# Altium project TM_DE_REV1.0.PrjPcb (part 2 of 2)

## Sheet 04_USB_UART_Service.SchDoc: USB_UART_Service
size A4; DrawnBy: YILDIRIM_DOGRU
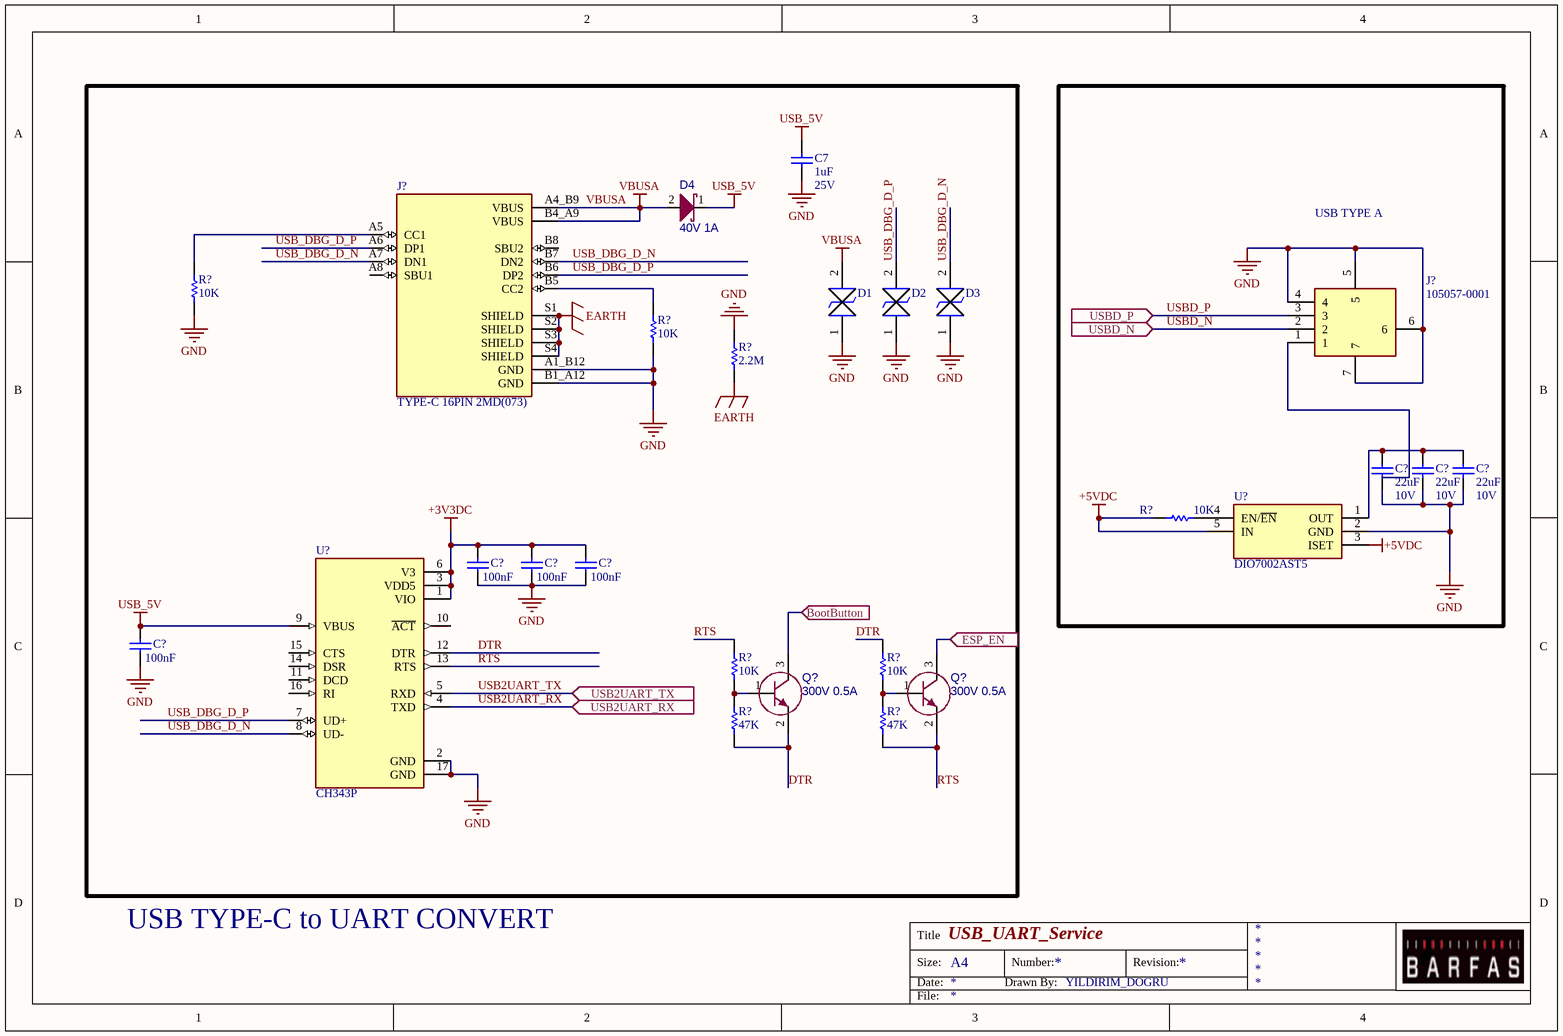
[diagram p9: 04_USB_UART_Service.SchDoc]

### Parts
(Parts that share a designator on the sheet are numbered #1, #2 ... from top to bottom, then left to right.)
C7#1  value 1uF  Voltage: 25V  [CAP_0603]  (hidden comment: CL10A105KA8NNNC)
C?#13  value 22uF  Voltage: 10V  [CAP_0805]  (hidden comment: CL21A226MPCLRNC)
C?#14  value 22uF  Voltage: 10V  [CAP_0805]  (hidden comment: CL21A226MPCLRNC)
C?#15  value 22uF  Voltage: 10V  [CAP_0805]  (hidden comment: CL21A226MPCLRNC)
C?#16  value 100nF  [CAP_0603]  (hidden comment: CL10B104KB8NNNL)
C?#17  value 100nF  [CAP_0603]  (hidden comment: CL10B104KB8NNNL)
C?#18  value 100nF  [CAP_0603]  (hidden comment: CL10B104KB8NNNL)
C?#19  value 100nF  [CAP_0603]  (hidden comment: CL10B104KB8NNNL)
D1#1  ATV02W5V0B-HF  [SODFL3718X130N]  (value not drawn)
D2  ATV02W5V0B-HF  [SODFL3718X130N]  (value not drawn)
D3#2  ATV02W5V0B-HF  [SODFL3718X130N]  (value not drawn)
D4  value 40V 1A  [SOD-123]  (hidden comment: PMEG4010EGWJ)
J?#2  TYPE-C 16PIN 2MD(073)  [HRO_TYPE-C-31-M-12]
J?#3  105057-0001  [1050570001]
Q?#1  value 300V 0.5A  [SOT-23-3]  (hidden comment: MMBTA42_R1_00001)
Q?#2  value 300V 0.5A  [SOT-23-3]  (hidden comment: MMBTA42_R1_00001)
R?#1  value 10K  [RES_0402]  (hidden comment: RC0402JR-0710KL)
R?#2  value 10K  [RES_0402]  (hidden comment: RC0402JR-0710KL)
R?#3  value 2.2M  [RES_0805]  (hidden comment: RES)
R?#4  value 10K  [RES_0402]  (hidden comment: RC0402JR-0710KL)
R?#5  value 10K  [RES_0402]  (hidden comment: RC0402JR-0710KL)
R?#6  value 10K  [RES_0402]  (hidden comment: RC0402JR-0710KL)
R?#7  value 47K  [RES_0603]  (hidden comment: 0603SAF4702T5E)
R?#8  value 47K  [RES_0603]  (hidden comment: 0603SAF4702T5E)
U?#15  DIO7002AST5  [SOT95P280X125-5N]
U?#16  CH343P  [QFN50P300X300X80-17N]

### Blocks framed on the sheet
USB TYPE A: C?#13-C?#15 J?#3 R?#4 U?#15

### Ports
BootButton (in), ESP_EN (in), USB2UART_RX (in), USB2UART_TX (in), USBD_N (in), USBD_P (in)

### Nets
+3V3DC: C?#16.2 C?#17.2 C?#18.2 U?#16.1(VIO) U?#16.3(VDD5) U?#16.6(V3)
+5VDC: R?#4.2 U?#15.3(ISET) U?#15.5(IN)
EARTH: J?#2.S1(SHIELD) J?#2.S2(SHIELD) J?#2.S3(SHIELD) J?#2.S4(SHIELD) R?#3.1
GND: C7#1.2 C?#13.2 C?#14.2 C?#15.2 C?#16.1 C?#17.1 C?#18.1 C?#19.1 D1#1.1 D2.1 D3#2.1 J?#2.A1_B12(GND) J?#2.B1_A12(GND) J?#3.4 J?#3.5 J?#3.6 J?#3.7 R?#1.1 R?#2.1 R?#3.2 U?#15.2(GND) U?#16.2(GND) U?#16.17(GND)  [project net TVSS]
USB_5V: C7#1.1 C?#19.2 D4.1 U?#16.9(VBUS)
VBUSA: D1#1.2 D4.2 J?#2.A4_B9(VBUS) J?#2.B4_A9(VBUS)
DTR: Q?#1.2(E) R?#6.2 R?#7.1 U?#16.12(DTR)
RTS: Q?#2.2(E) R?#5.2 R?#8.1 U?#16.13(RTS)
USB2UART_RX: U?#16.4(TXD) ; port USB2UART_RX
USB2UART_TX: U?#16.5(RXD) ; port USB2UART_TX
USB_DBG_D_N: D3#2.2 J?#2.A7(DN1) J?#2.B7(DN2) U?#16.8(UD-)
USB_DBG_D_P: D2.2 J?#2.A6(DP1) J?#2.B6(DP2) U?#16.7(UD+)
USBD_N: J?#3.2 ; port USBD_N
USBD_P: J?#3.3 ; port USBD_P
NetC?#13_1: C?#13.1 C?#14.1 C?#15.1 U?#15.1(OUT)
NetJ?#2_A5: J?#2.A5(CC1) R?#1.2
NetJ?#2_B5: J?#2.B5(CC2) R?#2.2
NetQ?#1_1: Q?#1.1(B) R?#5.1 R?#7.2
NetQ?#1_3: Q?#1.3(C) ; port BootButton
NetQ?#2_1: Q?#2.1(B) R?#6.1 R?#8.2
NetQ?#2_3: Q?#2.3(C) ; port ESP_EN
NetR?#4_1: R?#4.1 U?#15.4(EN/~{EN})

Not connected (* = marked no-connect by the designer): J?#2 A8(SBU1) B8(SBU2); J?#3 1; U?#16 10(~{ACT}) 11(DCD) 14(DSR) 15(CTS) 16(RI)

### Notes on the sheet
- USB TYPE-C to UART CONVERT
- Title
- Size:
- Date:
- A4
- Drawn By:
- Number:
- Revision:
- File:

### Library data of the parts
C7#1 = C01757: CAP CER 1UF 25VDC %10 X5R SMD; Manufacturer: Samsung; Manufacturer Part Number: CL10A105KA8NNNC
C?#13-C?#15 = C01758: MLCC (2012) 0805 22uF 10VDC ±20% X5R; Manufacturer: Samsung; Manufacturer Part Number: CL21A226MPCLRNC
C?#16-C?#19 = CL10B104KB8NNNL: MLCC (1608) 0603 100nF 50VDC ±10% X7R; Manufacturer: Samsung Electro-Mechanics America, Inc; Supplier 1: OZDISAN; Manufacturer Part Number: CL10B104KB8NNNL
D1#1 D2 D3#2 = ATV02W5V0B-HF: TVS Diode (Bi-directional); Manufacturer: Comchip Technology; Manufacturer Part Number: ATV02W5V0B-HF
D4 = PMEG4010EGWJ: DIODE SCHOTTKY 40V 1A SOD123; Manufacturer: Nexperia USA Inc.; Manufacturer Part Number: PMEG4010EGWJ
J?#2 = TYPE-C-31-M-12: CONN RCPT Type-C 16POS SMD R/A; Manufacturer: SHOU HAN; Value: *; Manufacturer Part Number: TYPE-C 16PIN 2MD(073)
J?#3 = 105057-0001: CONN RCPT USB2.0 TYPEA 4POS VERT; Manufacturer: Molex; Manufacturer Part Number: 105057-0001
Q?#1 Q?#2 = MMBTA42_R1_00001: as Q12#1 on sheet 07_LTE_GNSS; Package: SOT23; Supplier Part Number 1: 3757-MMBTA42_R1_00001CT-ND; Supplier Part Number 2: *; Supplier Part Number 3: MMBTA42_R1_00001; Supplier 1: DIGIKEY; Supplier 2: MOUSER; Supplier 3: OZDISAN; Manufacturer Part Number: MMBTA42_R1_00001
R?#1 R?#2 R?#4-R?#6 = R03000: as R16#3 on sheet 07_LTE_GNSS; Manufacturer Part Number: RC0402JR-0710KL
R?#3 = R01913: RES SMD 2.2M OHM 1% 1/8W 0805; Manufacturer: Yageo; Manufacturer Part Number: RC0805FR-072M2L
R?#7 R?#8 = 0603SAF4702T5E: as R17 on sheet 07_LTE_GNSS; Supplier 1: Ozdisan; Manufacturer Part Number: 0603SAF4702T5E
U?#15 = DIO7002AST5: Low Loss Power Distribution Switch; Manufacturer: DIOO Microcircuits; Manufacturer Part Number: DIO7002AST5
U?#16 = CH343P: USB to High-Speed Serial Chip CH343; Manufacturer: WCH; SnapEDA_Link: https://www.snapeda.com/parts/CH343P/WCH/view-part/?ref=snap; Package: Package; Value: *; Manufacturer Part Number: CH343P; Check_prices: https://www.snapeda.com/parts/CH343P/WCH/view-part/?ref=eda

## Sheet 03_Vehicle_Interfaces.SchDoc: Vehicle Interfaces
size A4; DrawnBy: YILDIRIM_DOGRU
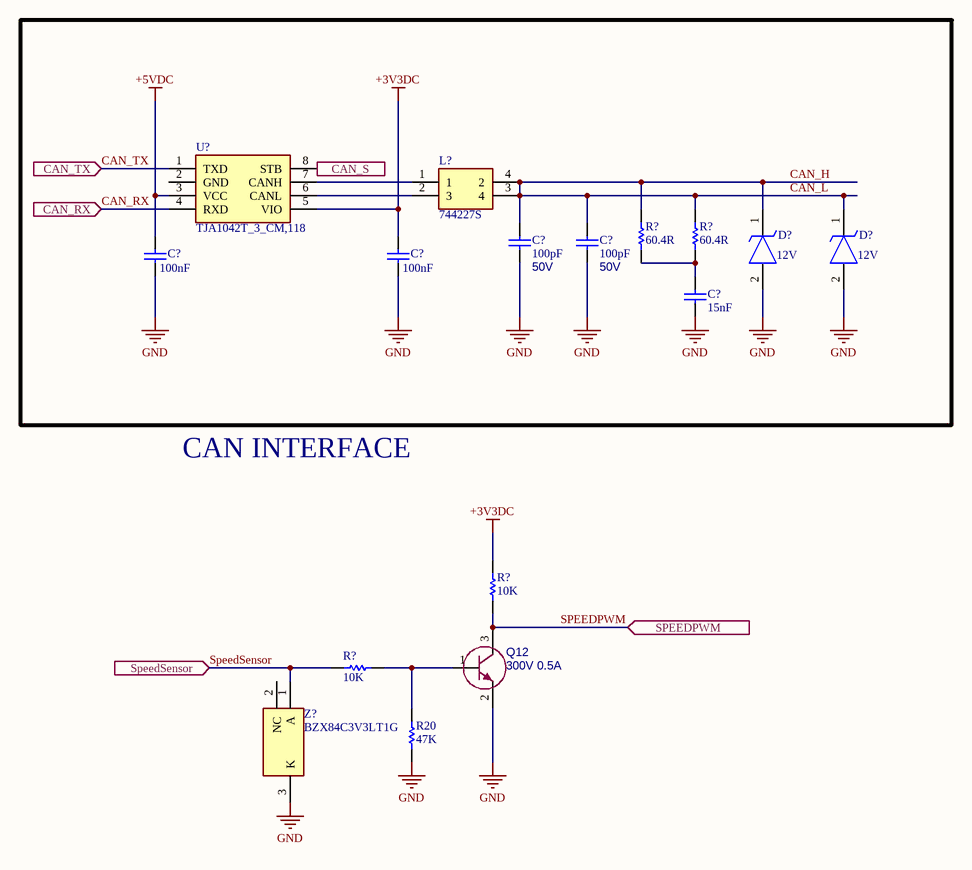
[diagram p10: 03_Vehicle_Interfaces.SchDoc]

### Parts
(Parts that share a designator on the sheet are numbered #1, #2 ... from top to bottom, then left to right.)
C?#20  value 100pF  Voltage: 50V  [CAP_0402]  (hidden comment: CC0402JRNPO9BN101)
C?#21  value 100pF  Voltage: 50V  [CAP_0402]  (hidden comment: CC0402JRNPO9BN101)
C?#22  value 100nF  [CAP_0603]  (hidden comment: CL10B104KB8NNNL)
C?#23  value 100nF  [CAP_0603]  (hidden comment: CL10B104KB8NNNL)
C?#24  value 15nF  [CAP_0603]  (hidden comment: CL10B153KB85PNC)
D?#1  value 12V  [DIOM5436X244N]  (hidden comment: SMBJ12A)
D?#2  value 12V  [DIOM5436X244N]  (hidden comment: SMBJ12A)
L?#1  744227S  [WE-SL274]
Q12#2  value 300V 0.5A  [SOT-23-3]  (hidden comment: MMBTA42_R1_00001)
R20#2  value 47K  [RES_0603]  (hidden comment: 0603SAF4702T5E)
R?#9  value 60.4R  [RES_0603]  (hidden comment: 0603SAF604JT5E)
R?#10  value 60.4R  [RES_0603]  (hidden comment: 0603SAF604JT5E)
R?#11  value 10K  [RES_0402]  (hidden comment: RC0402JR-0710KL)
R?#12  value 10K  [RES_0402]  (hidden comment: RC0402JR-0710KL)
U?#17  TJA1042T_3_CM,118  [SOIC127P600X175-8N]
Z?  BZX84C3V3LT1G  [SOT96P237X111-3N]

### Ports
CAN_RX (in), CAN_S (in), CAN_TX (in), SPEEDPWM (in), SpeedSensor (in)

### Nets
+3V3DC: C?#23.2 R?#11.1 U?#17.5(VIO)
+5VDC: C?#22.2 U?#17.3(VCC)
GND: C?#20.2 C?#21.2 C?#22.1 C?#23.1 C?#24.1 D?#1.2(A) D?#2.2(A) Q12#2.2(E) R20#2.1 Z?.3(K)  [project net TVSS]
CAN_H: C?#20.1 C?#21.1 D?#1.1(K) D?#2.1(K) L?#1.3(4) L?#1.4(2) R?#9.2 R?#10.2  [also labelled CAN_L]
CAN_RX: U?#17.4(RXD) ; port CAN_RX
CAN_TX: U?#17.1(TXD) ; port CAN_TX
SPEEDPWM: Q12#2.3(C) R?#11.2 ; port SPEEDPWM
SpeedSensor: R?#12.1 Z?.1(A) ; port SpeedSensor
NetC?#24_2: C?#24.2 R?#9.1 R?#10.1
NetL?#1_1: L?#1.1 U?#17.7(CANH)
NetL?#1_2: L?#1.2(3) U?#17.6(CANL)
NetQ12#2_1: Q12#2.1(B) R20#2.2 R?#12.2
NetU?#17_8: U?#17.8(STB) ; port CAN_S

Not connected (* = marked no-connect by the designer): U?#17 2(GND); Z? 2(NC)

### Notes on the sheet
- CAN INTERFACE
- Title
- Size:
- Date:
- A4
- Drawn By:
- Number:
- Revision:
- File:

### Library data of the parts
C?#20 C?#21 = CL10B103KB8NNNL: MLCC (1005) 0402 100pF 50VDC ±5% C0G (NP0); Manufacturer: YAGEO; Manufacturer Part Number: CC0402JRNPO9BN101
C?#22 C?#23 = CL10B104KB8NNNL: as C?#16 on sheet 04_USB_UART_Service; Supplier 1: OZDISAN; Manufacturer Part Number: CL10B104KB8NNNL
C?#24 = CL10B153KB85PNC: MLCC (1608) 0603 15nF 50VDC ±10% X7R AUTOMOTIVE; Manufacturer: SAMSUNG; Supplier 1: OZDISAN; Manufacturer Part Number: CL10B153KB85PNC
D?#1 D?#2 = SMBJ12A: TVS, UNI-DIR, 600W, 12V, DO-214A; Manufacturer: Good-Ark Semiconductor; Manufacturer Part Number: SMBJ12A
L?#1 = 744227S: Inductor; Manufacturer_Name: Wurth Elektronik; Datasheet Link: https://www.we-online.com/catalog/datasheet/744227S.pdf; Height: 5mm; Manufacturer_Part_Number: 744227S; Mouser Part Number: 710-744227S; Mouser Price/Stock: https://www.mouser.co.uk/ProductDetail/Wurth-Elektronik/744227S?qs=PGXP4M47uW6UzRbcLRn7mw%3D%3D
Q12#2 = MMBTA42_R1_00001: as Q12#1 on sheet 07_LTE_GNSS; Package: SOT23; Supplier Part Number 1: 3757-MMBTA42_R1_00001CT-ND; Supplier Part Number 2: *; Supplier Part Number 3: MMBTA42_R1_00001; Supplier 1: DIGIKEY; Supplier 2: MOUSER; Supplier 3: OZDISAN; Manufacturer Part Number: MMBTA42_R1_00001
R20#2 = 0603SAF4702T5E: as R17 on sheet 07_LTE_GNSS; Supplier 1: Ozdisan; Manufacturer Part Number: 0603SAF4702T5E
R?#9 R?#10 = 0603SAJ0220T5E: RES.(1608) 0603 60.4 Ohms 1% 1/10W-S 200PPM; Manufacturer: ROYALOHM; Supplier 1: Ozdisan; Manufacturer Part Number: 0603SAF604JT5E
R?#11 R?#12 = R03000: as R16#3 on sheet 07_LTE_GNSS; Manufacturer Part Number: RC0402JR-0710KL
U?#17 = TJA1042T_3_CM,118: Integrated Circuit; Manufacturer_Name: NXP; Manufacturer_Part_Number: TJA1042T/3/CM,118; Datasheet Link: http://www.nxp.com/docs/en/data-sheet/TJA1042.pdf; Height: 1.75mm; Mouser Part Number: 771-TJA1042T/3/CM118; Mouser Price/Stock: https://www.mouser.co.uk/ProductDetail/NXP-Semiconductors/TJA1042T-3-CM118?qs=vbj%2FKoHZRAjPcMNWVApm4A%3D%3D; Arrow Part Number: TJA1042T/3/CM,118; Arrow Price/Stock: https://www.arrow.com/en/products/tja1042t3cm118/nxp-semiconductors.html?utm_currency=USD&region=nac
Z? = BZX84C3V3LT1G: Zener Diode; Manufacturer_Name: onsemi; Datasheet Link: https://www.onsemi.com/pub/Collateral/BZX84C2V4LT1-D.PDF; Height: 1.11mm; Manufacturer_Part_Number: BZX84C3V3LT1G; Mouser Part Number: 863-BZX84C3V3LT1G; Mouser Price/Stock: https://www.mouser.co.uk/ProductDetail/onsemi/BZX84C3V3LT1G?qs=vNc2DXHODiIKL62%252Be6h8Pg%3D%3D; Arrow Part Number: BZX84C3V3LT1G; Arrow Price/Stock: https://www.arrow.com/en/products/bzx84c3v3lt1g/on-semiconductor.html?utm_currency=USD&region=nac

## Sheet 02_MCU_ESP32P4.SchDoc: MCU_ESP32P4
size A3; DrawnBy: YILDIRIM_DOGRU
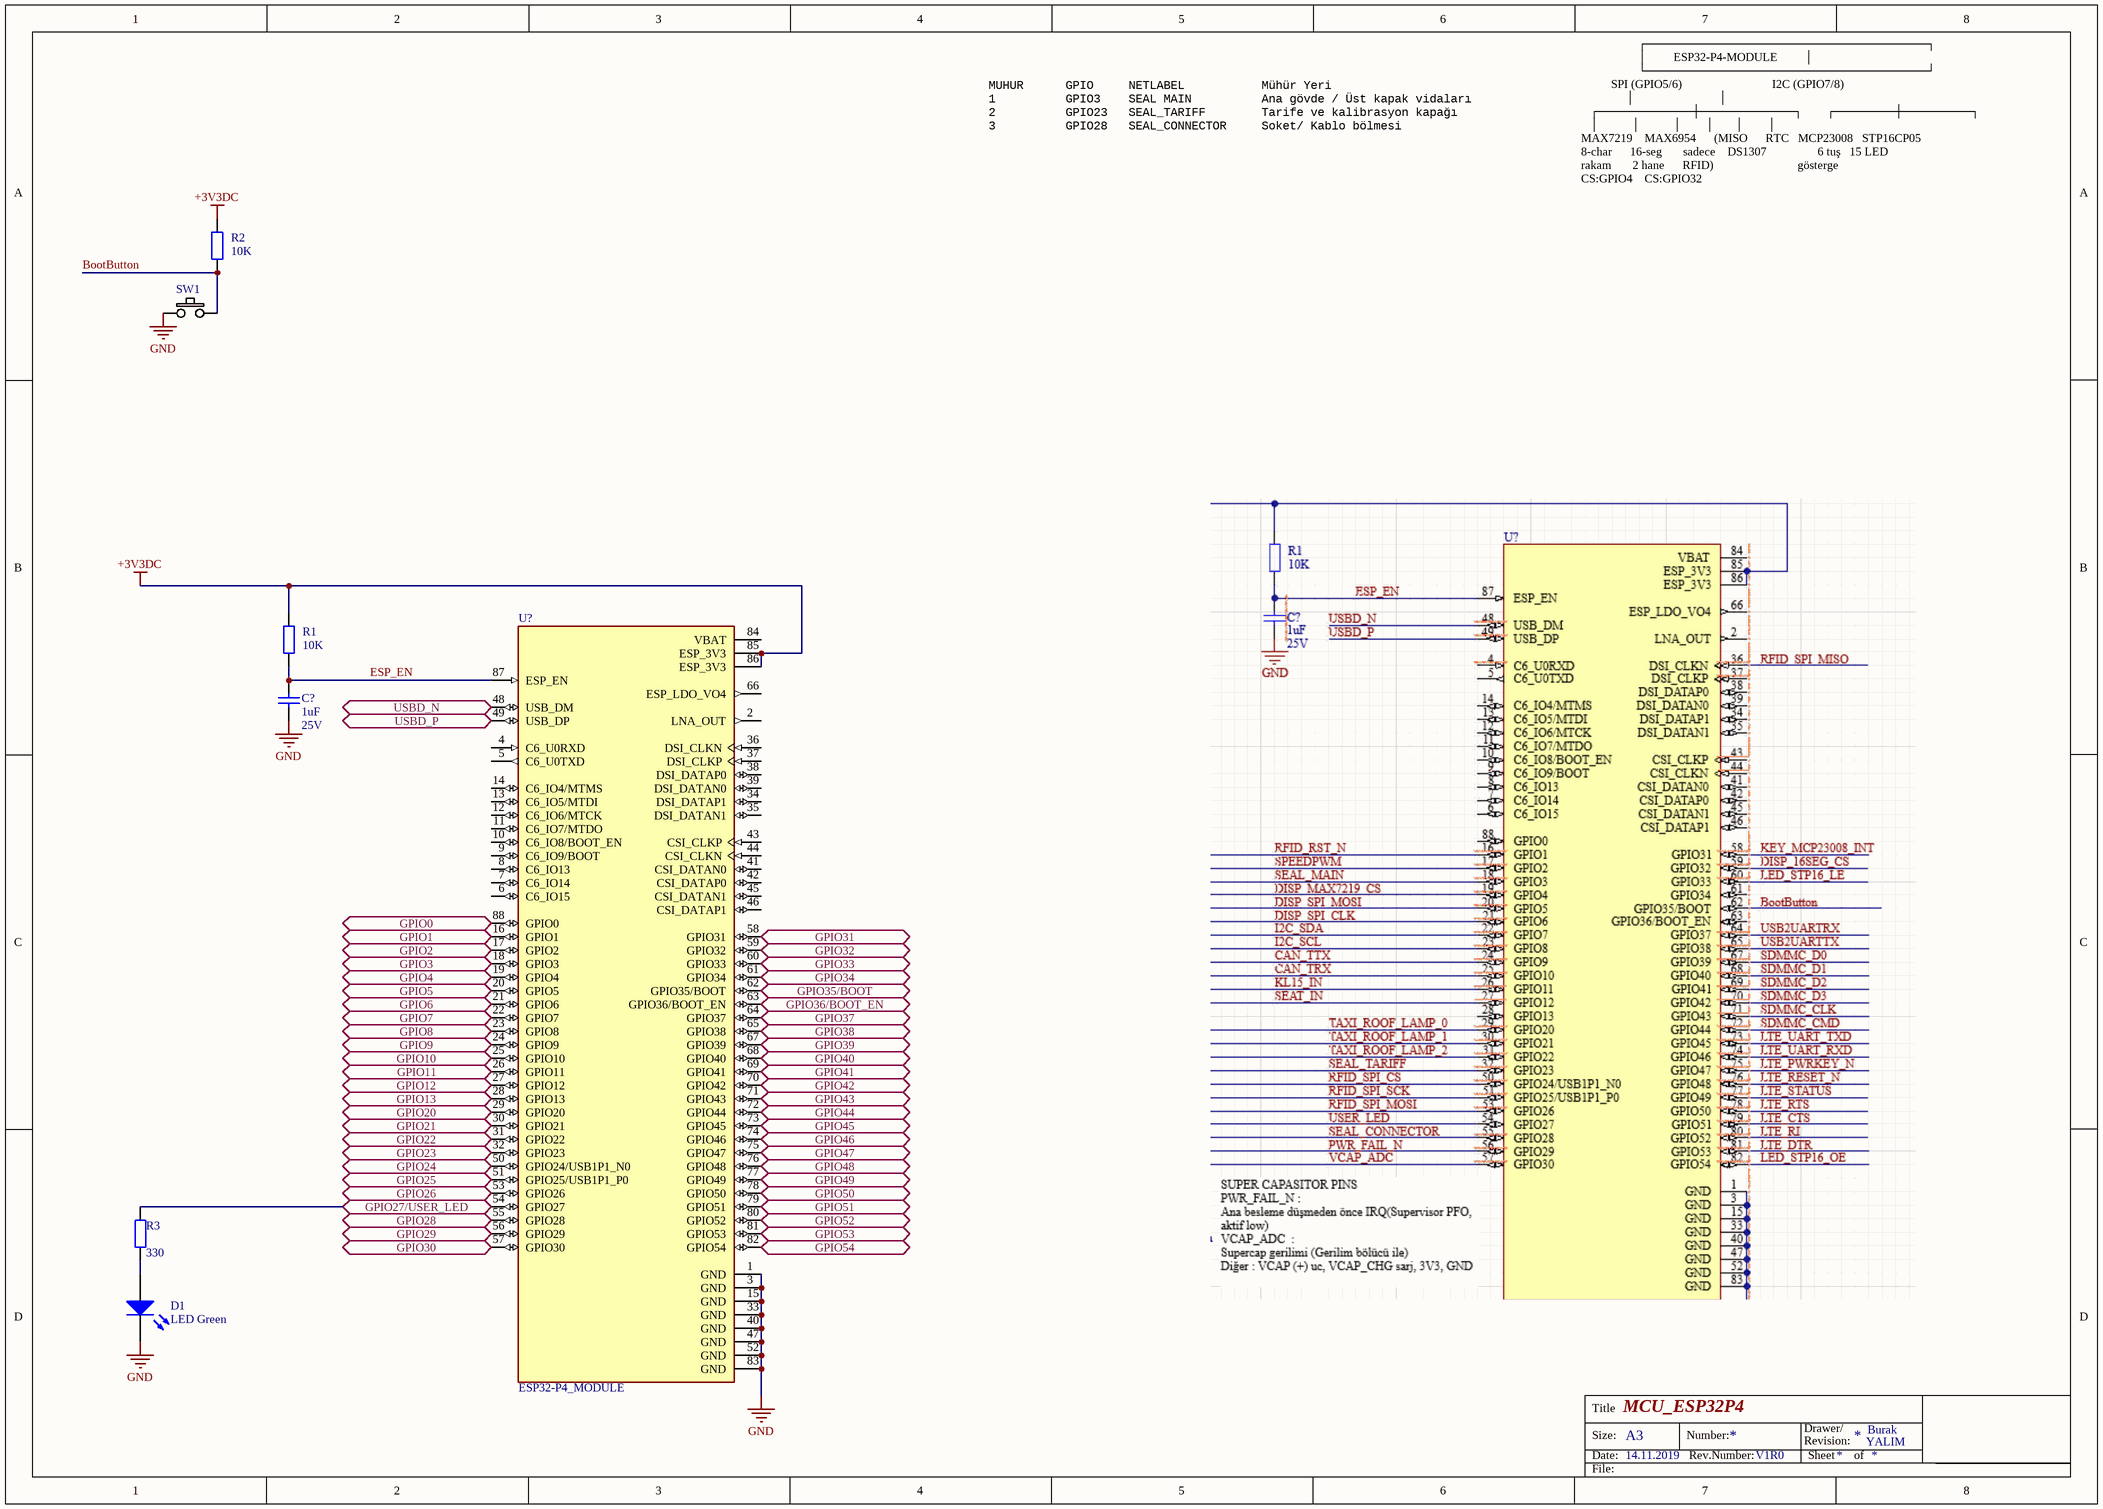
[diagram p11: 02_MCU_ESP32P4.SchDoc]

### Parts
(Parts that share a designator on the sheet are numbered #1, #2 ... from top to bottom, then left to right.)
C?#25  value 1uF  Voltage: 25V  [CAP_0603]  (hidden comment: CL10A105KA8NNNC)
D1#2  LED Green  [LED-1]
R1#1  value 10K  [AXIAL-0.4]  (hidden comment: R_CS)
R2#1  value 10K  [AXIAL-0.4]  (hidden comment: R_CS)
R3#1  value 330  [AXIAL-0.4]  (hidden comment: RG)
SW1  SW-PB-BLACK-SMD  [SW-PB-SMD]  (value not drawn)
U?#18  ESP32-P4_MODULE  [XCVR_ESP32-P4_MODULE]

### Ports
GPIO0 (bidir), GPIO1 (bidir), GPIO2 (bidir), GPIO3 (bidir), GPIO4 (bidir), GPIO5 (bidir), GPIO6 (bidir), GPIO7 (bidir), GPIO8 (bidir), GPIO9 (bidir), GPIO10 (bidir), GPIO11 (bidir), GPIO12 (bidir), GPIO13 (bidir), GPIO20 (bidir), GPIO21 (bidir), GPIO22 (bidir), GPIO23 (bidir), GPIO24 (bidir), GPIO25 (bidir), GPIO26 (bidir), GPIO27/USER_LED (bidir), GPIO28 (bidir), GPIO29 (bidir), GPIO30 (bidir), GPIO31 (bidir), GPIO32 (bidir), GPIO33 (bidir), GPIO34 (bidir), GPIO35/BOOT (bidir), GPIO36/BOOT_EN (bidir), GPIO37 (bidir), GPIO38 (bidir), GPIO39 (bidir), GPIO40 (bidir), GPIO41 (bidir), GPIO42 (bidir), GPIO43 (bidir), GPIO44 (bidir), GPIO45 (bidir), GPIO46 (bidir), GPIO47 (bidir), GPIO48 (bidir), GPIO49 (bidir), GPIO50 (bidir), GPIO51 (bidir), GPIO52 (bidir), GPIO53 (bidir), GPIO54 (bidir), USBD_N (bidir), USBD_P (bidir)

### Nets
+3V3DC: R1#1.2 R2#1.2 U?#18.85(ESP_3V3) U?#18.86(ESP_3V3)
GND: C?#25.2 D1#2.2(K) SW1.1 U?#18.1(GND) U?#18.3(GND) U?#18.15(GND) U?#18.33(GND) U?#18.40(GND) U?#18.47(GND) U?#18.52(GND) U?#18.83(GND)  [project net TVSS]
BootButton: R2#1.1 SW1.2
ESP_EN: C?#25.1 R1#1.1 U?#18.87(ESP_EN)
NetD1#2_1: D1#2.1(A) R3#1.1
NetR3#1_2: R3#1.2 U?#18.54(GPIO27) ; port GPIO27/USER_LED
NetU?#18_16: U?#18.16(GPIO1) ; port GPIO1
NetU?#18_17: U?#18.17(GPIO2) ; port GPIO2
NetU?#18_18: U?#18.18(GPIO3) ; port GPIO3
NetU?#18_19: U?#18.19(GPIO4) ; port GPIO4
NetU?#18_20: U?#18.20(GPIO5) ; port GPIO5
NetU?#18_21: U?#18.21(GPIO6) ; port GPIO6
NetU?#18_22: U?#18.22(GPIO7) ; port GPIO7
NetU?#18_23: U?#18.23(GPIO8) ; port GPIO8
NetU?#18_24: U?#18.24(GPIO9) ; port GPIO9
NetU?#18_25: U?#18.25(GPIO10) ; port GPIO10
NetU?#18_26: U?#18.26(GPIO11) ; port GPIO11
NetU?#18_27: U?#18.27(GPIO12) ; port GPIO12
NetU?#18_28: U?#18.28(GPIO13) ; port GPIO13
NetU?#18_29: U?#18.29(GPIO20) ; port GPIO20
NetU?#18_30: U?#18.30(GPIO21) ; port GPIO21
NetU?#18_31: U?#18.31(GPIO22) ; port GPIO22
NetU?#18_32: U?#18.32(GPIO23) ; port GPIO23
NetU?#18_48: U?#18.48(USB_DM) ; port USBD_N
NetU?#18_49: U?#18.49(USB_DP) ; port USBD_P
NetU?#18_50: U?#18.50(GPIO24/USB1P1_N0) ; port GPIO24
NetU?#18_51: U?#18.51(GPIO25/USB1P1_P0) ; port GPIO25
NetU?#18_53: U?#18.53(GPIO26) ; port GPIO26
NetU?#18_55: U?#18.55(GPIO28) ; port GPIO28
NetU?#18_56: U?#18.56(GPIO29) ; port GPIO29
NetU?#18_57: U?#18.57(GPIO30) ; port GPIO30
NetU?#18_58: U?#18.58(GPIO31) ; port GPIO31
NetU?#18_59: U?#18.59(GPIO32) ; port GPIO32
NetU?#18_60: U?#18.60(GPIO33) ; port GPIO33
NetU?#18_61: U?#18.61(GPIO34) ; port GPIO34
NetU?#18_62: U?#18.62(GPIO35/BOOT) ; port GPIO35/BOOT
NetU?#18_63: U?#18.63(GPIO36/BOOT_EN) ; port GPIO36/BOOT_EN
NetU?#18_64: U?#18.64(GPIO37) ; port GPIO37
NetU?#18_65: U?#18.65(GPIO38) ; port GPIO38
NetU?#18_67: U?#18.67(GPIO39) ; port GPIO39
NetU?#18_68: U?#18.68(GPIO40) ; port GPIO40
NetU?#18_69: U?#18.69(GPIO41) ; port GPIO41
NetU?#18_70: U?#18.70(GPIO42) ; port GPIO42
NetU?#18_71: U?#18.71(GPIO43) ; port GPIO43
NetU?#18_72: U?#18.72(GPIO44) ; port GPIO44
NetU?#18_73: U?#18.73(GPIO45) ; port GPIO45
NetU?#18_74: U?#18.74(GPIO46) ; port GPIO46
NetU?#18_75: U?#18.75(GPIO47) ; port GPIO47
NetU?#18_76: U?#18.76(GPIO48) ; port GPIO48
NetU?#18_77: U?#18.77(GPIO49) ; port GPIO49
NetU?#18_78: U?#18.78(GPIO50) ; port GPIO50
NetU?#18_79: U?#18.79(GPIO51) ; port GPIO51
NetU?#18_80: U?#18.80(GPIO52) ; port GPIO52
NetU?#18_81: U?#18.81(GPIO53) ; port GPIO53
NetU?#18_82: U?#18.82(GPIO54) ; port GPIO54
NetU?#18_88: U?#18.88(GPIO0) ; port GPIO0

Not connected (* = marked no-connect by the designer): U?#18 2(LNA_OUT) 4(C6_U0RXD) 5(C6_U0TXD) 6(C6_IO15) 7(C6_IO14) 8(C6_IO13) 9(C6_IO9/BOOT) 10(C6_IO8/BOOT_EN) 11(C6_IO7/MTDO) 12(C6_IO6/MTCK) 13(C6_IO5/MTDI) 14(C6_IO4/MTMS) 34(DSI_DATAP1) 35(DSI_DATAN1) 36(DSI_CLKN) 37(DSI_CLKP) 38(DSI_DATAP0) 39(DSI_DATAN0) 41(CSI_DATAN0) 42(CSI_DATAP0) 43(CSI_CLKP) 44(CSI_CLKN) 45(CSI_DATAN1) 46(CSI_DATAP1) 66(ESP_LDO_VO4) 84(VBAT)

### Notes on the sheet
- MUHUR      GPIO     NETLABEL           Mühür Yeri
  1          GPIO3    SEAL MAIN          Ana gövde / Üst kapak vidaları
  2          GPIO23   SEAL_TARIFF        Tarife ve kalibrasyon kapağı
  3          GPIO28   SEAL_CONNECTOR     Soket/ Kablo bölmesi
- ┌─────────────────────────────────┐
  │         ESP32-P4-MODULE         │
  └─────────────────────────────────┘
  SPI (GPIO5/6)                              I2C (GPIO7/8)
  │                            │
  ┌───────────┼───────────┐        ┌───────┼────────┐
  │           │           │        │       │        │
  MAX7219    MAX6954      (MISO      RTC   MCP23008   STP16CP05
  8-char      16-seg       sadece    DS1307                 6 tuş   15 LED
  rakam       2 hane      RFID)                            gösterge
  CS:GPIO4    CS:GPIO32
- Title
- Size:
- Date:
- 14.11.2019
- A3
- Number:
- Rev.Number:
- V1R0
- Revision:
- Drawer/
- Sheet
- of
- YALIM
- Burak
- File:

### Library data of the parts
C?#25 = C01757: CAP CER 1UF 25VDC %10 X5R SMD; Manufacturer: Samsung; Manufacturer Part Number: CL10A105KA8NNNC
D1#2 = LED1: Typical RED GaAs LED; Published: 8-Jun-2000; LatestRevisionDate: 08-Jul-2005; LatestRevisionNote: Mech Layer 1 removed.; PackageReference: LED-1; Publisher: Altium Limited; PackageDescription: LED; 2 Leads
R1#1 R2#1 R3#1 = Res2: Resistor; Published: 8-Jun-2000; LatestRevisionDate: 17-Jul-2002; LatestRevisionNote: Re-released for DXP Platform.; PackageReference: AXIAL-0.4; Publisher: Altium Limited; PackageDescription: Axial Device, Thru-Hole; 2 Leads; 0.4 in Pin Spacing
SW1 = SW-PB-BLACK-SMD: PUSHBUTTON SWITCH 6MM SMD
U?#18 = ESP32-P4_MODULE: Dual-core RISC-V high-performance module ESP32-C6H8; Manufacturer: Waveshare Electronics; Manufacturer Part Number: ESP32-P4 Module; Value: *

## Sheet 01_Power_Protection.SchDoc: POWER
size A4; DrawnBy: YILDIRIM_DOGRU
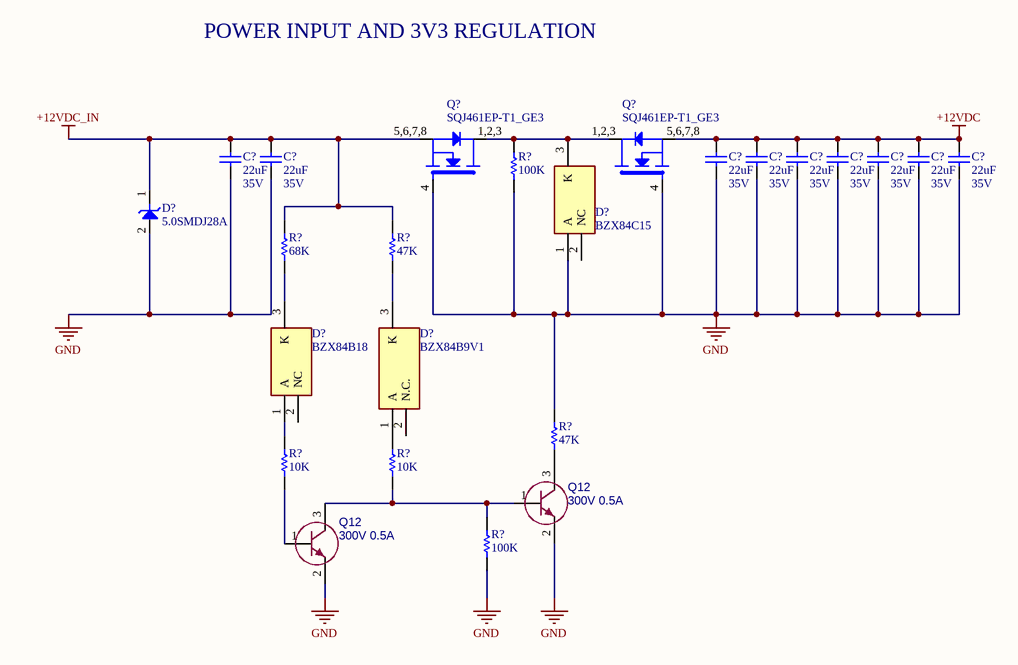
[diagram p12: 01_Power_Protection.SchDoc]

### Parts
(Parts that share a designator on the sheet are numbered #1, #2 ... from top to bottom, then left to right.)
C?#26  value 22uF  Voltage: 35V  [CAP_0805]  (hidden comment: GMC21X5R226M35NT)
C?#27  value 22uF  Voltage: 35V  [CAP_0805]  (hidden comment: GMC21X5R226M35NT)
C?#28  value 22uF  Voltage: 35V  [CAP_0805]  (hidden comment: GMC21X5R226M35NT)
C?#29  value 22uF  Voltage: 35V  [CAP_0805]  (hidden comment: GMC21X5R226M35NT)
C?#30  value 22uF  Voltage: 35V  [CAP_0805]  (hidden comment: GMC21X5R226M35NT)
C?#31  value 22uF  Voltage: 35V  [CAP_0805]  (hidden comment: GMC21X5R226M35NT)
C?#32  value 22uF  Voltage: 35V  [CAP_0805]  (hidden comment: GMC21X5R226M35NT)
C?#33  value 22uF  Voltage: 35V  [CAP_0805]  (hidden comment: GMC21X5R226M35NT)
C?#34  value 22uF  Voltage: 35V  [CAP_0805]  (hidden comment: GMC21X5R226M35NT)
D?#3  5.0SMDJ28A  [SMCJ58A]
D?#4  BZX84C15  [SOT95P240X120-3N]
D?#5  BZX84B18  [SOT95P240X110-3N]
D?#6  BZX84B9V1  [SOT95P240X110-3N]
Q12#3  value 300V 0.5A  [SOT-23-3]  (hidden comment: MMBTA42_R1_00001)
Q12#4  value 300V 0.5A  [SOT-23-3]  (hidden comment: MMBTA42_R1_00001)
Q?#3  SQJ461EP-T1_GE3  [SOT323]
Q?#4  SQJ461EP-T1_GE3  [SOT323]
R?#13  value 100K  [RES_0402]  (hidden comment: 0402WGF1003TCE)
R?#14  value 68K  [RES_0402]  (hidden comment: 0402WGF6802TCE)
R?#15  value 47K  [RES_0603]  (hidden comment: 0603SAF4702T5E)
R?#16  value 47K  [RES_0603]  (hidden comment: 0603SAF4702T5E)
R?#17  value 10K  [RES_0402]  (hidden comment: RC0402JR-0710KL)
R?#18  value 10K  [RES_0402]  (hidden comment: RC0402JR-0710KL)
R?#19  value 100K  [RES_0402]  (hidden comment: 0402WGF1003TCE)

### Nets
+12VDC: C?#28.1 C?#29.1 C?#30.1 C?#31.1 C?#32.1 C?#33.1 C?#34.1 Q?#4.5,6,7,8(S)
+12VDC_IN: C?#26.1 C?#27.1 D?#3.1 Q?#3.5,6,7,8(S) R?#14.2 R?#15.2
GND: C?#26.2 C?#27.2 C?#28.2 C?#29.2 C?#30.2 C?#31.2 C?#32.2 C?#33.2 C?#34.2 D?#3.2 D?#4.1(A) Q12#3.2(E) Q12#4.2(E) Q?#3.4(G) Q?#4.4(G) R?#13.1 R?#16.2 R?#19.1  [project net TVSS]
NetD?#4_3: D?#4.3(K) Q?#3.1,2,3(D) Q?#4.1,2,3(D) R?#13.2
NetD?#5_1: D?#5.1(A) R?#17.2
NetD?#5_3: D?#5.3(K) R?#14.1
NetD?#6_1: D?#6.1(A) R?#18.2
NetD?#6_3: D?#6.3(K) R?#15.1
NetQ12#3_1: Q12#3.1(B) Q12#4.3(C) R?#18.1 R?#19.2
NetQ12#3_3: Q12#3.3(C) R?#16.1
NetQ12#4_1: Q12#4.1(B) R?#17.1

Not connected (* = marked no-connect by the designer): D?#4 2(NC); D?#5 2(NC); D?#6 2(N.C.)

### Notes on the sheet
- POWER INPUT AND 3V3 REGULATION
- Title
- Size:
- Date:
- A4
- Drawn By:
- Number:
- Revision:
- File:

### Library data of the parts
C?#26-C?#34 = C01758: 22 µF ±20% 35V Ceramic Capacitor X5R 0805 (2012 Metric); Manufacturer: Cal-Chip Electronics, Inc.; Manufacturer Part Number: GMC21X5R226M35NT
D?#3 = 5.0SMDJ28A: 45.4V Clamp 110A Ipp Tvs Diode Surface Mount DO-214AB (SMC); Manufacturer: Bourns Inc.; Datasheet Link: https://www.diodes.com/part/view/SMCJ58A; Height: 2.5mm; Manufacturer Part Number: 5.0SMDJ28A; Mouser Part Number: N/A; Mouser Price/Stock: https://www.mouser.co.uk/ProductDetail/Diodes-Incorporated/SMCJ58A?qs=evjyFmOIEsnFZCuxUMyzBg%3D%3D
D?#4 = BZX84C15: Zener Diode; Manufacturer: Diotec; Manufacturer Part Number: BZX84C15
D?#5 = BZX84B18: Zener Diode; Manufacturer: PANJIT; Manufacturer Part Number: BZX84B18
D?#6 = BZX84B9V1: Zener Diode; Manufacturer: PANJIT; Manufacturer Part Number: BZX84B9V1
Q12#3 Q12#4 = MMBTA42_R1_00001: TRANSISTOR DIS.500mA 300V NPN SOT23 GEN. SMT; Manufacturer: PANJIT; Package: SOT23; Supplier Part Number 1: 3757-MMBTA42_R1_00001CT-ND; Supplier Part Number 2: *; Supplier Part Number 3: MMBTA42_R1_00001; Supplier 1: DIGIKEY; Supplier 2: MOUSER; Supplier 3: OZDISAN; Manufacturer Part Number: MMBTA42_R1_00001
Q?#3 Q?#4 = SQJ461EP-T1_GE3: P-Channel 60 V 30A (Tc) 83W (Tc) Surface Mount PowerPAK® SO-8; Manufacturer: Vishay Siliconix; Value: *; Supplier 1: OZDISAN; Manufacturer Part Number: SQJ461EP-T1_GE3
R?#13 R?#19 = R03000: RES.(1005) 0402 100K Ohms 1% 1/16W 100PPM; Manufacturer: ROYALOHM; Manufacturer Part Number: 0402WGF1003TCE
R?#14 = R03000: RES.(1005) 0402 68K Ohms 1% 1/16W 100PPM; Manufacturer: ROYALOHM; Manufacturer Part Number: 0402WGF6802TCE
R?#15 R?#16 = 0603SAF4702T5E: RES.(1608) 0603 47K Ohms 1% 1/10W-S 100PPM; Manufacturer: ROYALOHM; Supplier 1: Ozdisan; Manufacturer Part Number: 0603SAF4702T5E
R?#17 R?#18 = R03000: RES.(1005) 0402 10K Ohms 5% 1/16W 100PPM SMT; Manufacturer: YAGEO; Manufacturer Part Number: RC0402JR-0710KL

## Sheet 01_Power_Regulations.SchDoc
size A4; DrawnBy: YILDIRIM DOĞRU
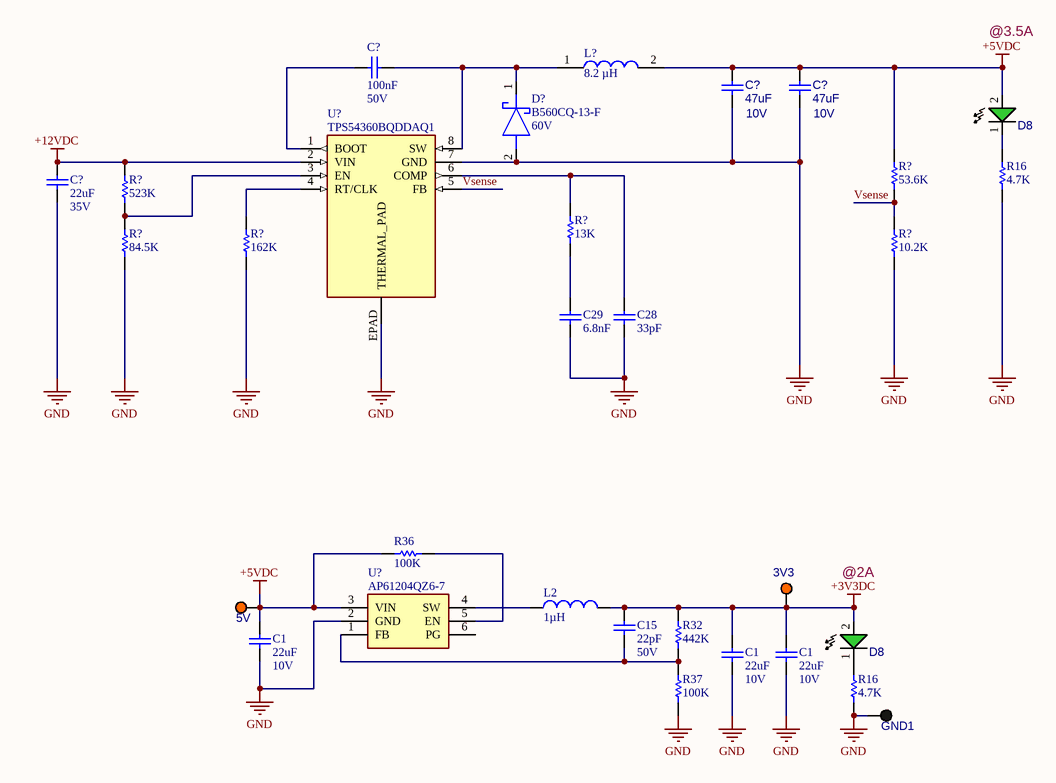
[diagram p13: 01_Power_Regulations.SchDoc]

### Parts
(Parts that share a designator on the sheet are numbered #1, #2 ... from top to bottom, then left to right.)
3V3  L-KLS8-TP5003  [TEST_POINT_ORANGE]  (value not drawn)
5V  L-KLS8-TP5003  [TEST_POINT_ORANGE]  (value not drawn)
C1#1  value 22uF  Voltage: 10V  [CAP_0805]  (hidden comment: CL21A226MPCLRNC)
C1#2  value 22uF  Voltage: 10V  [CAP_0805]  (hidden comment: CL21A226MPCLRNC)
C1#3  value 22uF  Voltage: 10V  [CAP_0805]  (hidden comment: CL21A226MPCLRNC)
C15#2  value 22pF  Voltage: 50V  [CAP_0603]  (hidden comment: CAP)
C28#2  value 33pF  [CAP_0603]  (hidden comment: CL10C330JB8NNNC)
C29#2  value 6.8nF  [CAP_0603]  (hidden comment: CC0603KRX7R9BB682)
C?#35  value 100nF  Voltage: 50V  [CAP_0603]  (hidden comment: CAP)
C?#36  value 47uF  Voltage: 10V  [CAP_1206]  (hidden comment: CL31A476MPHNNNE)
C?#37  value 47uF  Voltage: 10V  [CAP_1206]  (hidden comment: CL31A476MPHNNNE)
C?#38  value 22uF  Voltage: 35V  [CAP_0805]  (hidden comment: GMC21X5R226M35NT)
D8#2  LTST-C190TGKT  [LED_0603_GREEN]  (value not drawn)
D8#3  LTST-C190TGKT  [LED_0603_GREEN]  (value not drawn)
D?#7  B560CQ-13-F  value 60V  [DIOM7959X250N]
GND1  L-KLS8-TP5001  [TEST_POINT_BLACK]  (value not drawn)
L2#1  value 1µH  [FPI0302-2R2M]  (hidden comment: FPI0302-1R0M)
L?#2  value 8.2 µH  [7447797360]  (hidden comment: 7447797820)
R16#5  value 4.7K  [RES_0603]  (hidden comment: 0603SAF4701T5E)
R16#6  value 4.7K  [RES_0603]  (hidden comment: 0603SAF4701T5E)
R32  value 442K  [RES_0603]  (hidden comment: RES)
R36  value 100K  [RES_0603]  (hidden comment: RES)
R37  value 100K  [RES_0603]  (hidden comment: RES)
R?#20  value 53.6K  [RES_0402]  (hidden comment: 0402WGF5362TCE)
R?#21  value 523K  [RES_0402]  (hidden comment: 0402WGF5233TCE)
R?#22  value 10.2K  [RES_0402]  (hidden comment: 0402WGF1022TCE)
R?#23  value 13K  [RES_0402]  (hidden comment: 0402WGF1302TCE)
R?#24  value 84.5K  [RES_0402]  (hidden comment: 0402WGF8452TCE)
R?#25  value 162K  [RES_0402]  (hidden comment: 0402WGF1623TCE)
U?#19  TPS54360BQDDAQ1  [DDA8_3P1X2P4_TEX]
U?#20  AP61204QZ6-7  [AP61204QZ67]

### Nets
+3V3DC: 3V3.1 C1#2.1 C1#3.1 C15#2.1 D8#3.2 L2#1.2 R32.1
+5VDC: 5V.1 C1#1.1 C?#36.1 C?#37.1 D8#2.2 L?#2.2 R36.1 R?#20.1 U?#20.3(VIN)
+12VDC: C?#38.1 R?#21.2 U?#19.2(VIN)
GND: C1#1.2 C1#2.2 C1#3.2 C28#2.2 C29#2.2 C?#36.2 C?#37.2 C?#38.2 D?#7.2(A) GND1.1 R16#5.1 R16#6.1 R37.1 R?#22.2 R?#24.1 R?#25.1 U?#19.7(GND) U?#19.EPAD(THERMAL_PAD) U?#20.2(GND)  [project net TVSS]
Vsense: R?#20.2 R?#22.1 U?#19.5(FB)
NetC15#2_2: C15#2.2 R32.2 R37.2 U?#20.1(FB)
NetC28#2_1: C28#2.1 R?#23.2 U?#19.6(COMP)
NetC29#2_1: C29#2.1 R?#23.1
NetC?#35_1: C?#35.1 U?#19.1(BOOT)
NetC?#35_2: C?#35.2 D?#7.1(K) L?#2.1 U?#19.8(SW)
NetD8#2_1: D8#2.1 R16#5.2
NetD8#3_1: D8#3.1 R16#6.2
NetL2#1_1: L2#1.1 U?#20.4(SW)
NetR36_2: R36.2 U?#20.5(EN)
NetR?#21_1: R?#21.1 R?#24.2 U?#19.3(EN)
NetR?#25_2: R?#25.2 U?#19.4(RT/CLK)

Not connected (* = marked no-connect by the designer): U?#20 6(PG)

### Notes on the sheet
- @3.5A
- @2A
- Title
- Size:
- Date:
- A4
- Drawn By:
- Number:
- Revision:
- File:

### Library data of the parts
3V3 5V = 5003: PC TEST POINT MINIATURE ORANGE 2.54MMX4.60MM; Manufacturer: KLS ELECTRONIC; Package: 1mm THT Pad; Manufacturer Part Number: L-KLS8-TP5003
C1#1-C1#3 = C01758: MLCC (2012) 0805 22uF 10VDC ±20% X5R; Manufacturer: Samsung; Manufacturer Part Number: CL21A226MPCLRNC
C15#2 = C01769: MLCC 0603 22pF 50VDC ±5% C0G (NP0); Manufacturer: Samsung; Manufacturer Part Number: CL10C220JB8NNNC
C28#2 = CL10C330JB8NNNC: MLCC (1608) 0603 33pF 50VDC ±5% C0G (NP0); Manufacturer: Samsung Electro-Mechanics America, Inc; Supplier 1: OZDISAN; Manufacturer Part Number: CL10C330JB8NNNC
C29#2 = CL10C330JB8NNNC: MLCC (1608) 0603 6.8nF 50VDC ±10% X7R; Manufacturer: YAGEO; Supplier 1: OZDISAN; Manufacturer Part Number: CC0603KRX7R9BB682
C?#35 = C01763: CAP CER 100nF 50VDC %10 X7R SMD; Manufacturer: Samsung; Manufacturer Part Number: CL10B104KB8NNNL
C?#36 C?#37 = CL31A106KBHNNNE: MLCC (3216) 1206 47uF 10VDC ±20% X5R; Manufacturer: SAMSUNG; Package: 1206 (3216 Metric); Manufacturer Part Number: CL31A476MPHNNNE
C?#38 = C01758: as C?#26 on sheet 01_Power_Protection; Manufacturer Part Number: GMC21X5R226M35NT
D8#2 D8#3 = LTST-C190TGKT: LED SMD 0603 GREEN 71-450mcd 130° WATER CLEAR; Manufacturer: LITEON; Package: 0603(1608 Metric); Manufacturer Part Number: LTST-C190TGKT; Value: GREEN
D?#7 = B560CQ-13-F: DIODE SCHOTTKY 60V 5A SMC; Manufacturer: Diodes Incorporated; Manufacturer Part Number: B560CQ-13-F
GND1 = 5001: PC TEST POINT MINIATURE BLACK 2.54MMX4.60MM; Manufacturer: KLS ELECTRONIC; Package: 1mm THT Pad; Manufacturer Part Number: L-KLS8-TP5001
L2#1 = IND0000019: INDUCTOR POWER 1UH 3.3X3MM SMD; Manufacturer: Core Master; Manufacturer Part Number: FPI0302-1R0M
L?#2 = 7447797820: 8.2 µH Shielded Drum Core, Wirewound Inductor 5.05 A 28.6mOhm Max Nonstandard; Manufacturer: Wurth Elektronik; Manufacturer Part Number: 7447797820
R16#5 R16#6 = 0603SAF4701T5E: RES.(1608) 0603 4.7K Ohms 1% 1/10W-S 100PPM; Manufacturer: ROYALOHM; Supplier 1: Ozdisan; Manufacturer Part Number: 0603SAF4701T5E
R32 = R03014: RES 0603 442K Ohms 1% 1/10W-S 100PPM; Manufacturer: ROYALOHM; Manufacturer Part Number: 0603SAF4423T5E
R36 R37 = R03011: RES 0603 100K Ohms 1% 1/10W-S 100PPM; Manufacturer: ROYALOHM; Manufacturer Part Number: 0603SAF1003T5E
R?#20 = R03000: RES.(1005) 0402 53.6K Ohms 1% 1/16W 100PPM; Manufacturer: ROYALOHM; Manufacturer Part Number: 0402WGF5362TCE
R?#21 = R03000: RES.(1005) 0402 523K Ohms 1% 1/16W 100PPM; Manufacturer: ROYALOHM; Manufacturer Part Number: 0402WGF5233TCE
R?#22 = R03000: RES.(1005) 0402 10.2K Ohms 1% 1/16W 100PPM; Manufacturer: ROYALOHM; Manufacturer Part Number: 0402WGF1022TCE
R?#23 = R03000: RES.(1005) 0402 13K Ohms 1% 1/16W 100PPM; Manufacturer: ROYALOHM; Manufacturer Part Number: 0402WGF1302TCE
R?#24 = R03000: RES.(1005) 0402 84.5K Ohms 1% 1/16W 100PPM; Manufacturer: ROYALOHM; Manufacturer Part Number: 0402WGF8452TCE
R?#25 = R03000: RES.(1005) 0402 162K Ohms 1% 1/16W 100PPM; Manufacturer: ROYALOHM; Manufacturer Part Number: 0402WGF1623TCE
U?#19 = TPS54360BQDDAQ1: Automotive, 60V Input, 3.5A, Step-Down DC-DC Converter With Eco-mode&trade; 8-SO PowerPAD -40 to 125; Manufacturer: Texas Instruments; Copyright: Copyright (C) 2026 Ultra Librarian. All rights reserved.; Manufacturer Part Number: TPS54360BQDDAQ1; RefDes: RefDes; Type: Type
U?#20 = AP61204QZ6-7: Integrated Circuit; Manufacturer_Name: Diodes Incorporated; Datasheet Link: https://www.diodes.com/datasheet/download/AP61204Q.pdf; Height: 0.6mm; Manufacturer_Part_Number: AP61204QZ6-7

## Sheet 05_Taxi_Toplight.SchDoc: Taxi_Toplight
size A4; DrawnBy: YILDIRIM_DOGRU
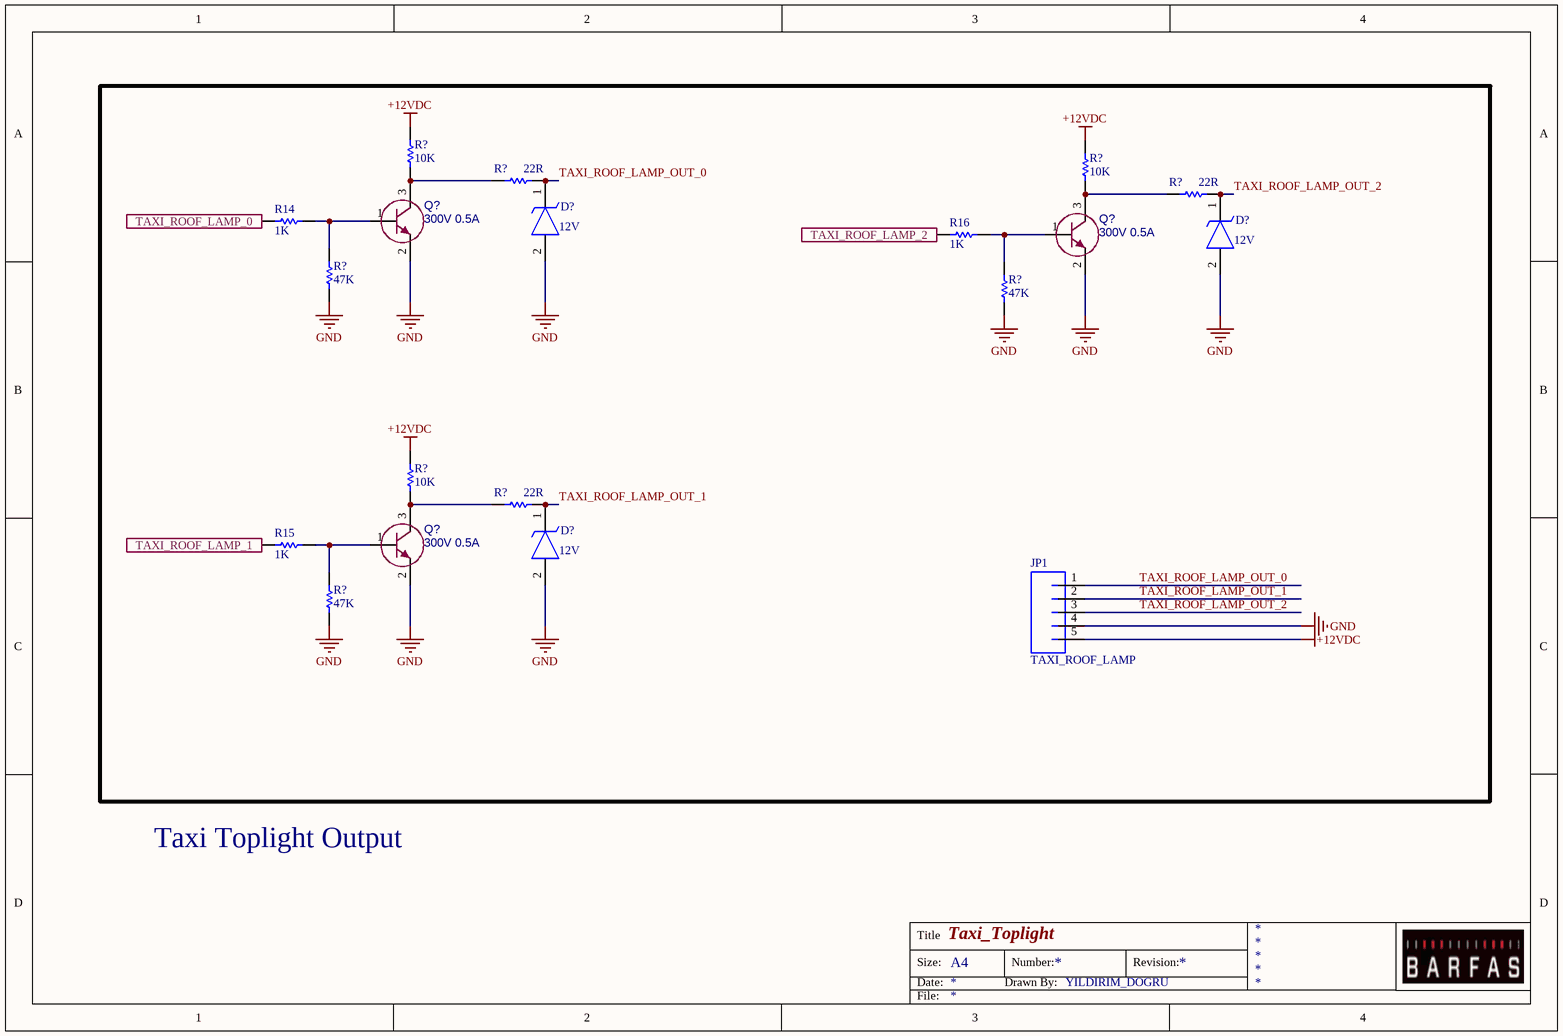
[diagram p14: 05_Taxi_Toplight.SchDoc]

### Parts
(Parts that share a designator on the sheet are numbered #1, #2 ... from top to bottom, then left to right.)
D?#8  value 12V  [DIOM5436X244N]  (hidden comment: SMBJ12A)
D?#9  value 12V  [DIOM5436X244N]  (hidden comment: SMBJ12A)
D?#10  value 12V  [DIOM5436X244N]  (hidden comment: SMBJ12A)
JP1  TAXI_ROOF_LAMP  [JST-XH-5-PTH-VERT]
Q?#5  value 300V 0.5A  [SOT-23-3]  (hidden comment: MMBTA42_R1_00001)
Q?#6  value 300V 0.5A  [SOT-23-3]  (hidden comment: MMBTA42_R1_00001)
Q?#7  value 300V 0.5A  [SOT-23-3]  (hidden comment: MMBTA42_R1_00001)
R14#2  value 1K  [RES_0603]  (hidden comment: 0603SAF1001T5E)
R15#2  value 1K  [RES_0603]  (hidden comment: 0603SAF1001T5E)
R16#7  value 1K  [RES_0603]  (hidden comment: 0603SAF1001T5E)
R?#26  value 10K  [RES_0402]  (hidden comment: RC0402JR-0710KL)
R?#27  value 10K  [RES_0402]  (hidden comment: RC0402JR-0710KL)
R?#28  value 22R  [RES_0603]  (hidden comment: 0603SAJ0220T5E)
R?#29  value 22R  [RES_0603]  (hidden comment: 0603SAJ0220T5E)
R?#30  value 47K  [RES_0603]  (hidden comment: 0603SAF4702T5E)
R?#31  value 47K  [RES_0603]  (hidden comment: 0603SAF4702T5E)
R?#32  value 10K  [RES_0402]  (hidden comment: RC0402JR-0710KL)
R?#33  value 22R  [RES_0603]  (hidden comment: 0603SAJ0220T5E)
R?#34  value 47K  [RES_0603]  (hidden comment: 0603SAF4702T5E)

### Ports
TAXI_ROOF_LAMP_0 (in), TAXI_ROOF_LAMP_1 (in), TAXI_ROOF_LAMP_2 (in)

### Nets
+12VDC: JP1.5 R?#26.1 R?#27.1 R?#32.1
GND: D?#8.2(A) D?#9.2(A) D?#10.2(A) JP1.4 Q?#5.2(E) Q?#6.2(E) Q?#7.2(E) R?#30.1 R?#31.1 R?#34.1  [project net TVSS]
TAXI_ROOF_LAMP_OUT_0: D?#8.1(K) JP1.1 R?#28.2
TAXI_ROOF_LAMP_OUT_1: D?#10.1(K) JP1.2 R?#33.2
TAXI_ROOF_LAMP_OUT_2: D?#9.1(K) JP1.3 R?#29.2
NetQ?#5_1: Q?#5.1(B) R14#2.1 R?#30.2
NetQ?#5_3: Q?#5.3(C) R?#26.2 R?#28.1
NetQ?#6_1: Q?#6.1(B) R16#7.1 R?#31.2
NetQ?#6_3: Q?#6.3(C) R?#27.2 R?#29.1
NetQ?#7_1: Q?#7.1(B) R15#2.1 R?#34.2
NetQ?#7_3: Q?#7.3(C) R?#32.2 R?#33.1
NetR14#2_2: R14#2.2 ; port TAXI_ROOF_LAMP_0
NetR15#2_2: R15#2.2 ; port TAXI_ROOF_LAMP_1
NetR16#7_2: R16#7.2 ; port TAXI_ROOF_LAMP_2

### Notes on the sheet
- Taxi Toplight Output
- Title
- Size:
- Date:
- A4
- Drawn By:
- Number:
- Revision:
- File:

### Library data of the parts
D?#8-D?#10 = SMBJ12A: TVS, UNI-DIR, 600W, 12V, DO-214A; Manufacturer: Good-Ark Semiconductor; Manufacturer Part Number: SMBJ12A
JP1 = JST_XH_5_VERT: Manufacturer: JST Sales America, Inc.; PartNumber: B5B-XH-A(LF)(SN); Mounting Technology: Through Hole; PackageReference: JST-XH
Q?#5-Q?#7 = MMBTA42_R1_00001: as Q12#3 on sheet 01_Power_Protection; Package: SOT23; Supplier Part Number 1: 3757-MMBTA42_R1_00001CT-ND; Supplier Part Number 2: *; Supplier Part Number 3: MMBTA42_R1_00001; Supplier 1: DIGIKEY; Supplier 2: MOUSER; Supplier 3: OZDISAN; Manufacturer Part Number: MMBTA42_R1_00001
R14#2 R15#2 R16#7 = 0603SAF1001T5E: RES.(1608) 0603 1K Ohms 1% 1/10W-S 100PPM; Manufacturer: ROYALOHM; Supplier 1: Ozdisan; Manufacturer Part Number: 0603SAF1001T5E
R?#26 R?#27 R?#32 = R03000: as R?#17 on sheet 01_Power_Protection; Manufacturer Part Number: RC0402JR-0710KL
R?#28 R?#29 R?#33 = 0603SAJ0220T5E: RES.(1608) 0603 22 Ohms 5% 1/10W-S 200PPM; Manufacturer: ROYALOHM; Supplier 1: Ozdisan; Manufacturer Part Number: 0603SAJ0220T5E
R?#30 R?#31 R?#34 = 0603SAF4702T5E: as R?#15 on sheet 01_Power_Protection; Supplier 1: Ozdisan; Manufacturer Part Number: 0603SAF4702T5E

## Sheet 06_RFID_RTC_Storage.SchDoc: RFID_RTC_Storage
size A4; DrawnBy: YILDIRIM_DOGRU
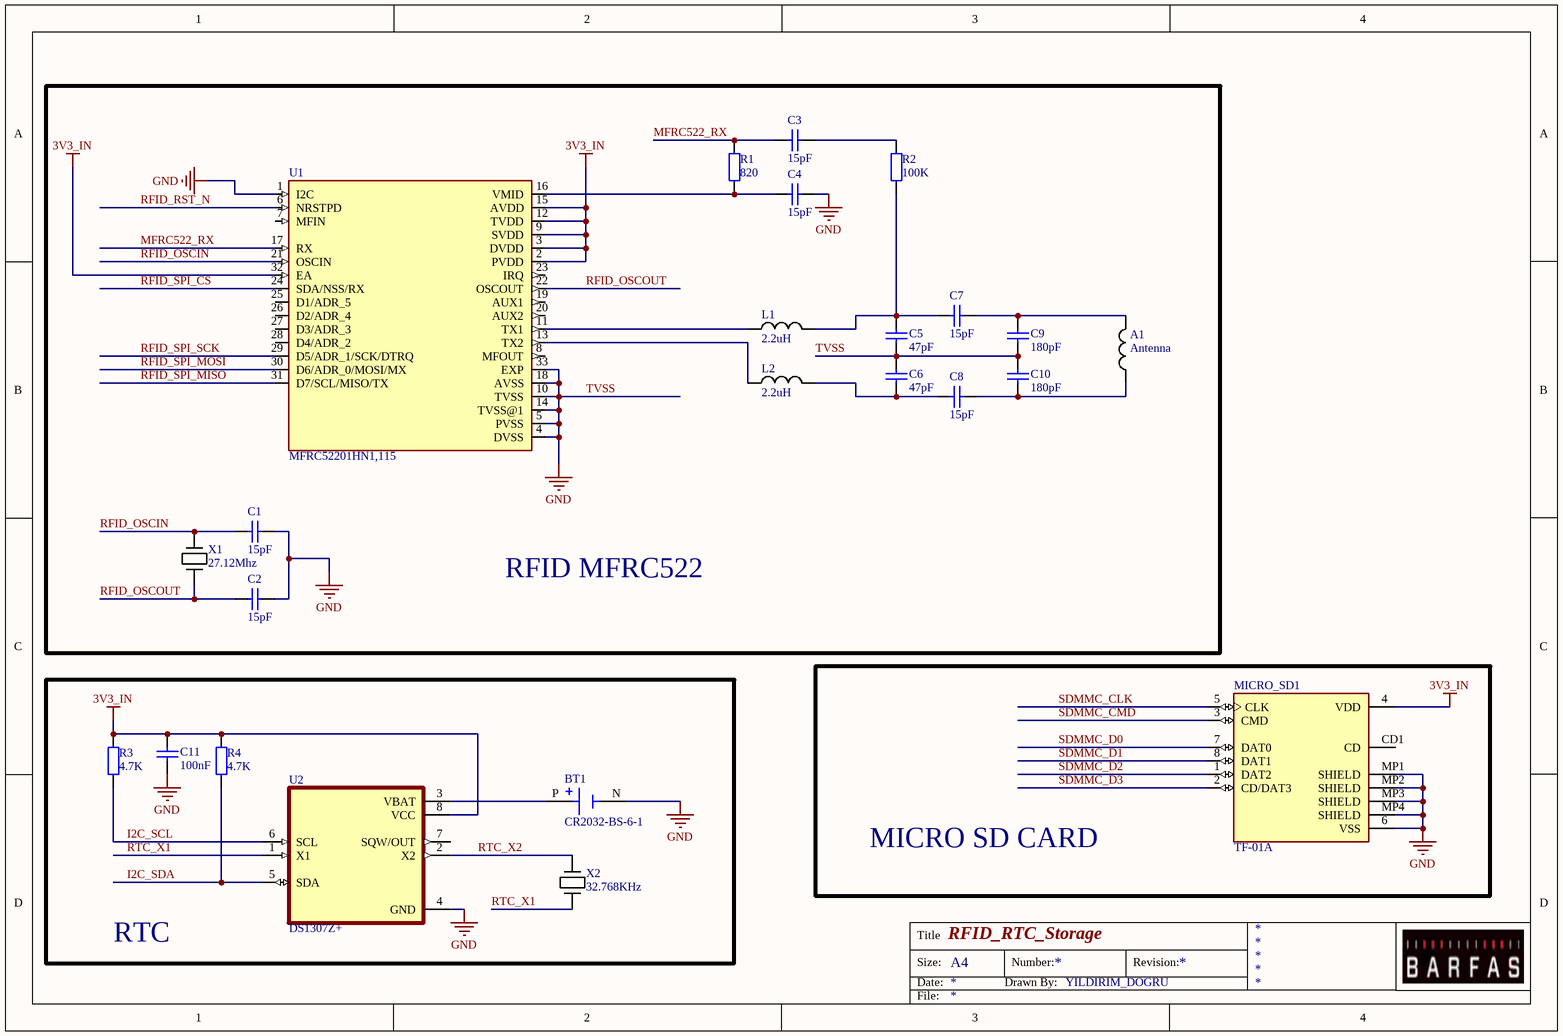
[diagram p15: 06_RFID_RTC_Storage.SchDoc]

### Parts
(Parts that share a designator on the sheet are numbered #1, #2 ... from top to bottom, then left to right.)
A1  Antenna  [TDK-VLS3012-1U]
BT1  CR2032-BS-6-1  [BAT_CR2032-BS-6-1]
C1#4  value 15pF  [RAD-0.3]  (hidden comment: Cap)
C2#2  value 15pF  [RAD-0.3]  (hidden comment: Cap)
C3#2  value 15pF  [RAD-0.3]  (hidden comment: Cap)
C4  value 15pF  [RAD-0.3]  (hidden comment: Cap)
C5  value 47pF  [RAD-0.3]  (hidden comment: Cap)
C6  value 47pF  [RAD-0.3]  (hidden comment: Cap)
C7#2  value 15pF  [RAD-0.3]  (hidden comment: Cap)
C8  value 15pF  [RAD-0.3]  (hidden comment: Cap)
C9  value 180pF  [RAD-0.3]  (hidden comment: Cap)
C10  value 180pF  [RAD-0.3]  (hidden comment: Cap)
C11  value 100nF  [RAD-0.3]  (hidden comment: Cap)
L1  2.2uH  [TDK-VLS3012-1U]
L2#2  2.2uH  [TDK-VLS3012-1U]
MICRO_SD1  TF-01A  [TF-01A]
R1#2  value 820  [AXIAL-0.4]  (hidden comment: R_CS)
R2#2  value 100K  [AXIAL-0.4]  (hidden comment: R_CS)
R3#2  value 4.7K  [AXIAL-0.4]  (hidden comment: R_CS)
R4#13  value 4.7K  [AXIAL-0.4]  (hidden comment: R_CS)
U1  MFRC52201HN1,115  [QFN50P500X500X100-33N]
U2  DS1307Z+  [SOIC127P600X175-8N]
X1  27.12Mhz  [XTAL-RU49/4]
X2  32.768KHz  [XTAL-RU49/4]

### Blocks framed on the sheet
RFID MFRC522: A1 C1#4 C2#2 C3#2 C4-C6 C7#2 C8-C10 L1 L2#2 R1#2 R2#2 U1 X1
MICRO SD CARD: MICRO_SD1
RTC: BT1 C11 R3#2 R4#13 U2 X2

### Nets
3V3_IN: C11.1 MICRO_SD1.4(VDD) R3#2.1 R4#13.1 U1.2(PVDD) U1.3(DVDD) U1.9(SVDD) U1.12(TVDD) U1.15(AVDD) U1.32(EA) U2.8(VCC)
TVSS: BT1.N(NEG) C1#4.1 C2#2.1 C4.1 C5.2 C6.1 C9.2 C10.1 C11.2 MICRO_SD1.6(VSS) MICRO_SD1.MP1(SHIELD) MICRO_SD1.MP2(SHIELD) MICRO_SD1.MP3(SHIELD) MICRO_SD1.MP4(SHIELD) U1.1(I2C) U1.4(DVSS) U1.5(PVSS) U1.10(TVSS) U1.14(TVSS@1) U1.18(AVSS) U1.33(EXP) U2.4(GND)  [also labelled GND]
I2C_SCL: R3#2.2 U2.6(SCL)
I2C_SDA: R4#13.2 U2.5(SDA)
MFRC522_RX: C3#2.2 R1#2.1 U1.17(RX)
RFID_OSCIN: C1#4.2 U1.21(OSCIN) X1.1
RFID_OSCOUT: C2#2.2 U1.22(OSCOUT) X1.2
RFID_RST_N: U1.6(NRSTPD)
RFID_SPI_CS: U1.24(SDA/NSS/RX)
RFID_SPI_MISO: U1.31(D7/SCL/MISO/TX)
RFID_SPI_MOSI: U1.30(D6/ADR_0/MOSI/MX)
RFID_SPI_SCK: U1.29(D5/ADR_1/SCK/DTRQ)
RTC_X1: U2.1(X1) X2.2
RTC_X2: U2.2(X2) X2.1
SDMMC_CLK: MICRO_SD1.5(CLK)
SDMMC_CMD: MICRO_SD1.3(CMD)
SDMMC_D0: MICRO_SD1.7(DAT0)
SDMMC_D1: MICRO_SD1.8(DAT1)
SDMMC_D2: MICRO_SD1.1(DAT2)
SDMMC_D3: MICRO_SD1.2(CD/DAT3)
NetA1_1: A1.1 C8.1 C10.2
NetA1_2: A1.2 C7#2.1 C9.1
NetBT1_P: BT1.P(POS) U2.3(VBAT)
NetC3#2_1: C3#2.1 R2#2.1
NetC4_2: C4.2 R1#2.2 U1.16(VMID)
NetC5_1: C5.1 C7#2.2 L1.2 R2#2.2
NetC6_2: C6.2 C8.2 L2#2.2
NetL1_1: L1.1 U1.11(TX1)
NetL2#2_1: L2#2.1 U1.13(TX2)

Not connected (* = marked no-connect by the designer): MICRO_SD1 CD1(CD); U1 7(MFIN) 8(MFOUT) 19(AUX1) 20(AUX2) 23(IRQ) 25(D1/ADR_5) 26(D2/ADR_4) 27(D3/ADR_3) 28(D4/ADR_2); U2 7(SQW/OUT)

### Notes on the sheet
- Title
- Size:
- Date:
- A4
- Drawn By:
- Number:
- Revision:
- File:

### Library data of the parts
A1 L1 L2#2 = 1U-VLS3012-TDK: TDK-VLS3012-1U; Manufacturer: TDK Corporation; Manufacturer Part Number: VLS3012T-1R0N2R2; Reel: L8; Supplier 1: Digi-Key; Supplier Part Number 1: 445-3682-2-ND
BT1 = CR2032-BS-6-1: Battery base CR2032 SMD Battery Connectors ROHS; MF: Shenzhen Q&J Electronics Co. Ltd; Package: Package; Check_prices: https://www.snapeda.com/parts/CR2032-BS-6-1/Shenzhen+Q%2526J+Electronics+Co.+Ltd/view-part/?ref=eda; SnapEDA_Link: https://www.snapeda.com/parts/CR2032-BS-6-1/Shenzhen+Q%2526J+Electronics+Co.+Ltd/view-part/?ref=snap; MP: CR2032-BS-6-1; Value: *; Availability: Not in stock; Price: None
C1#4 C2#2 C3#2 C4-C6 C7#2 C8-C11 = Cap: Capacitor; Published: 8-Jun-2000; LatestRevisionDate: 17-Jul-2002; LatestRevisionNote: Re-released for DXP Platform.; PackageReference: RAD-0.3; Publisher: Altium Limited; PackageDescription: Radial Cap, Thru-Hole; 2 Leads; 0.3 in Pin Spacing
MICRO_SD1 = TF-01A: Standard Card Edge Connectors; MF: HRO Electronics Co., Ltd.; Price: None; Availability: Not in stock; MP: TF-01A; Package: Package; SnapEDA_Link: https://www.snapeda.com/parts/TF-01A/HRO+Electronics+Co.%252C+Ltd./view-part/?ref=snap; Check_prices: https://www.snapeda.com/parts/TF-01A/HRO+Electronics+Co.%252C+Ltd./view-part/?ref=eda; Value: *
R1#2 R2#2 R3#2 R4#13 = Res2: Resistor; Published: 8-Jun-2000; LatestRevisionDate: 17-Jul-2002; LatestRevisionNote: Re-released for DXP Platform.; PackageReference: AXIAL-0.4; Publisher: Altium Limited; PackageDescription: Axial Device, Thru-Hole; 2 Leads; 0.4 in Pin Spacing
U1 = MFRC52201HN1,115: RFID Reader IC 13.56MHz ISO 14443, MIFARE IÂ²C, SPI, UART 2.5V ~ 3.3V 32-VFQFN Exposed Pad; MF: NXP Semiconductors; SnapEDA_Link: https://www.snapeda.com/parts/MFRC52201HN1,115/NXP+Semiconductors/view-part/?ref=snap; Package: VFQFN-32 NXP Semiconductors; Value: *; MP: MFRC52201HN1,115; Check_prices: https://www.snapeda.com/parts/MFRC52201HN1,115/NXP+Semiconductors/view-part/?ref=eda
U2 = DS1307Z+: 64 x 8, Serial, IÂ²C Real-Time Clock; MF: Analog Devices; SnapEDA_Link: https://www.snapeda.com/parts/DS1307Z+/Analog+Devices/view-part/?ref=snap; Package: SOIC-8 Maxim; Value: *; MP: DS1307Z+; Check_prices: https://www.snapeda.com/parts/DS1307Z+/Analog+Devices/view-part/?ref=eda
X1 X2 = CRYSTAL-GENERIC: GENERIC CRYSTAL

## Nets that join several sheets
+3V3DC: 04_USB_UART_Service (6 pins), 03_Vehicle_Interfaces (C?#23.2 R?#11.1 U?#17.5), 02_MCU_ESP32P4 (R1#1.2 R2#1.2 U?#18.85 U?#18.86), 01_Power_Regulations (7 pins)
+5VDC: 08_Display_Leds (143 pins), 09_Display_Leds-2 (60 pins), 04_USB_UART_Service (R?#4.2 U?#15.3 U?#15.5), 03_Vehicle_Interfaces (C?#22.2 U?#17.3), 01_Power_Regulations (9 pins)
+12VDC: 01_Power_Protection (8 pins), 01_Power_Regulations (C?#38.1 R?#21.2 U?#19.2), 05_Taxi_Toplight (JP1.5 R?#26.1 R?#27.1 R?#32.1)
TVSS: 08_Display_Leds (18 pins), 09_Display_Leds-2 (8 pins), 07_LTE_GNSS (87 pins), 04_USB_UART_Service (23 pins), 03_Vehicle_Interfaces (10 pins), 02_MCU_ESP32P4 (11 pins), 01_Power_Protection (18 pins), 01_Power_Regulations (19 pins), 05_Taxi_Toplight (10 pins), 06_RFID_RTC_Storage (22 pins)